# Altium schematic sheet US_SB_USB.SchDoc
size A4
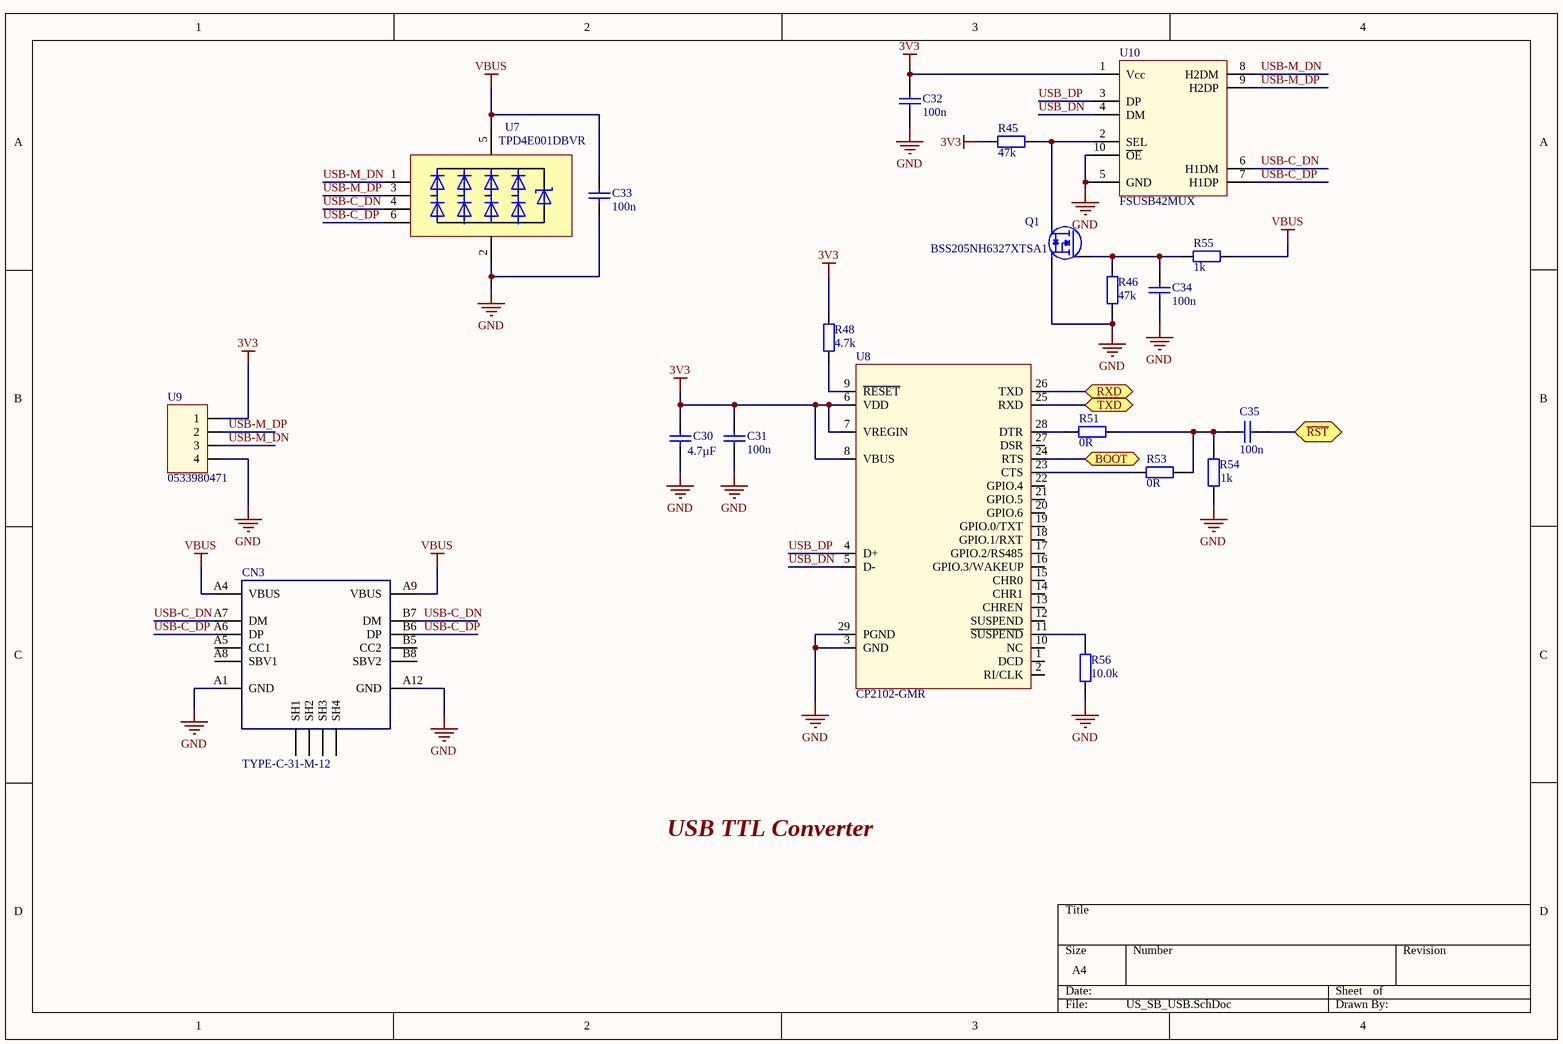
[diagram p0: US_SB_USB.SchDoc]

## Parts
C30  4.7µF  [C0603_IPC_HD]
C31  100n  [C0603_IPC_HD]
C32  100n  [C0603_IPC_HD]
C33  100n  [C0603_IPC_HD]
C34  100n  [C0603_IPC_HD]
C35  100n  [C0603_IPC_HD]
CN3  TYPE-C-31-M-12  [TYPE-C-C165948]
Q1  BSS205NH6327XTSA1
R45  47k  [R0603_IPC_HD]
R46  47k  [R0603_IPC_HD]
R48  4.7k  [R0603_IPC_HD]
R51  0R  [R0603_IPC_MD]
R53  0R  [R0603_IPC_MD]  (no BOM)
R54  1k  [R0603_IPC_MD]
R55  1k  [R0603_IPC_MD]
R56  10.0k  [R0603_IPC_MD]
U7  TPD4E001DBVR  [SOT23-6]
U8  CP2102-GMR  [CP2102\9_QFN50P500X500X80_HS-29N]
U9  0533980471  [PB_53261-0471_Right]
U10  FSUSB42MUX  [MSOP-10]

## Ports
BOOT, RXD, TXD, ~{RST}

## Nets
3V3: C30.2 C31.2 C32.2 R45.2 R48.2 U8.6(VDD) U8.7(VREGIN) U8.8(VBUS) U9.1 U10.1(Vcc)
GND: C30.1 C31.1 C32.1 C33.1 C34.1 CN3.A1(GND) CN3.A12(GND) Q1.2(S) R46.2 R54.1 R56.1 U7.2(GND) U8.3(GND) U8.29(PGND) U9.4 U10.5(GND) U10.10(~{OE})
VBUS: C33.2 CN3.A4(VBUS) CN3.A9(VBUS) R55.1 U7.5(VCC)
~{RST}: C35.1 ; port ~{RST}
BOOT: U8.24(RTS) ; port BOOT
RXD: U8.26(TXD) ; port RXD
TXD: U8.25(RXD) ; port TXD
USB-C_DN: CN3.A7(DM) CN3.B7(DM) U7.4(IO3) U10.6(H1DM)
USB-C_DP: CN3.A6(DP) CN3.B6(DP) U7.6(IO4) U10.7(H1DP)
USB-M_DN: U7.1(IO1) U9.3 U10.8(H2DM)
USB-M_DP: U7.3(IO2) U9.2 U10.9(H2DP)
USB_DN: U8.5(D-) U10.4(DM)
USB_DP: U8.4(D+) U10.3(DP)
NetC34_2: C34.2 Q1.1(G) R46.1 R55.2
NetC35_2: C35.2 R51.1 R53.1 R54.2
NetQ1_3: Q1.3(D) R45.1 U10.2(SEL)
NetR48_1: R48.1 U8.9(~{RESET})
NetR51_2: R51.2 U8.28(DTR)
NetR53_2: R53.2 U8.23(CTS)
NetR56_2: R56.2 U8.11(~{SUSPEND})

Not connected (* = marked no-connect by the designer): CN3 A5(CC1) A8(SBV1) B5(CC2) B8(SBV2) SH1 SH2 SH3 SH4; U8 1(DCD) 2(RI/CLK) 10(NC) 12(SUSPEND) 13(CHREN) 14(CHR1) 15(CHR0) 16(GPIO.3/WAKEUP) 17(GPIO.2/RS485) 18(GPIO.1/RXT) 19(GPIO.0/TXT) 20(GPIO.6) 21(GPIO.5) 22(GPIO.4) 27(DSR)

## Notes on the sheet
- USB TTL Converter

## Library data of the parts
C30 = CL0603_4.7uF_10V: 4.7µF ±10% 10V Ceramic Capacitor X5R 0603 (1608 Metric); Manufacturer: Samsung Electro-Mechanics; Manufacturer Part Number: CL10A475KP8NNNC; Dielectric: X7R; Voltage: 10V; Value: 4.7µF; Supplier 1: Digi-Key; Supplier Part Number 1: 1276-1044-1-ND
C31-C35 = CL10B104KO8NNNC: CAP CER 0.1UF 16V X7R 0603; Manufacturer: Samsung Electro-Mechanics; Manufacturer Part Number: CL10B104KO8NNNC; Voltage: 16V; Value: 100n; Dielectric: X7R; Supplier 1: Digi-Key; Supplier Part Number 1: 1276-1005-1-ND
CN3 = TYPE-C-31-M-12: TYPE C PCB TH CONN; Manufacturer: Korean Hroparts Elec; Manufacturer Part Number: TYPE-C-31-M-12; Supplier 1: LCSC; Supplier Part Number 1: C165948
Q1 = BSS205NH6327XTSA1: N-Channel 20V 2.5A (Ta) 500mW (Ta) Surface Mount SOT-23-3; Manufacturer: Infineon Technologies; Manufacturer Part Number: BSS205NH6327XTSA1; Supplier 1: Digi-Key; Supplier Part Number 1: BSS205NH6327XTSA1CT-ND
R45 R46 = CR0603-JW-473ELF: RES SMD 47K OHM 5% 1/10W 0603; Manufacturer: Bourns Inc.; Value: 47k; Tolarance: 5%; Manufacturer Part Number: CR0603-JW-473ELF; Supplier 1: Digi-Key; Supplier Part Number 1: CR0603-JW-473ELFCT-ND
R48 = CR0603-JW-4.7k: RES SMD 4.7K OHM 5% 1/10W 0603; Manufacturer: Bourns Inc.; Manufacturer Part Number: CR0603-JW-472ELF; Value: 4.7k; Tolarance: ±5%; Supplier 1: Digi-Key; Supplier Part Number 1: CR0603-JW-472ELFCT-ND
R51 R53 = CR0603-J/-000ELF: RES SMD 0 OHM JUMPER 1/10W 0603; Manufacturer: Bourns Inc.; Tolarance: 1%; Value: 0R; Manufacturer Part Number: CR0603-J/-000ELF; Supplier 1: Digi-Key; Supplier Part Number 1: CR0603-J/-000ELFCT-ND
R54 R55 = CR0603-JW-102ELF: RES SMD 1K OHM 5% 1/10W 0603; Manufacturer: Bourns Inc.; Value: 1k; Tolarance: 5%; Manufacturer Part Number: CR0603-JW-102ELF; Supplier 1: Digi-Key; Supplier Part Number 1: CR0603-JW-102ELFCT-ND
R56 = RMCF0603FT10K0: RES 10K OHM 1% 1/10W 0603; Manufacturer: Stackpole Electronics Inc; Value: 10.0k; Tolarance: 1%; Manufacturer Part Number: RMCF0603FT10K0; Supplier 1: Digi-Key; Supplier Part Number 1: RMCF0603FT10K0CT-ND
U7 = TPD4E001DBVR: 4x TVS DIODE 5.5V SOT23-6; Manufacturer: TI; Manufacturer Part Number: TPD4E001DBVR; Supplier 1: Digi-Key; Supplier Part Number 1: 296-28203-1-ND
U8 = CP2102N-A01-GQFN28R: USB Bridge, USB to UART USB 2.0 UART Interface 28-QFN (5x5); Manufacturer: Silicon Labs; Manufacturer Part Number: CP2102N-A01-GQFN28R; Supplier 1: Digi-Key; Supplier Part Number 1: 336-4738-1-ND
U9 = PB_053398_0471: Connector Header Surface Mount 4 position 0.049" (1.25mm); Manufacturer: Molex; Manufacturer Part Number: 0533980471; Supplier 1: Digi-Key; Supplier Part Number 1: WM7608TR-ND
U10 = FSUSB42MUX: IC USB SWITCH DPDT 10MSOP; Manufacturer: ON Semiconductor; Manufacturer Part Number: FSUSB42MUX; Supplier 1: Digi-Key; Supplier Part Number 1: FSUSB42MUXCT-ND